# EasyEDA Pro project musclemap_pcb_header.eprj, schematic Schematic1
Board Name: Board1; Create Date: 2025-11-26; Page Name: P1; Project Name: musclemap_pcb_revised; Schematic Name: Schematic1; Update Date: 2025-11-26; Company: DWAN; Drawn: DWAN; Page Size: A4; Version: V1.0
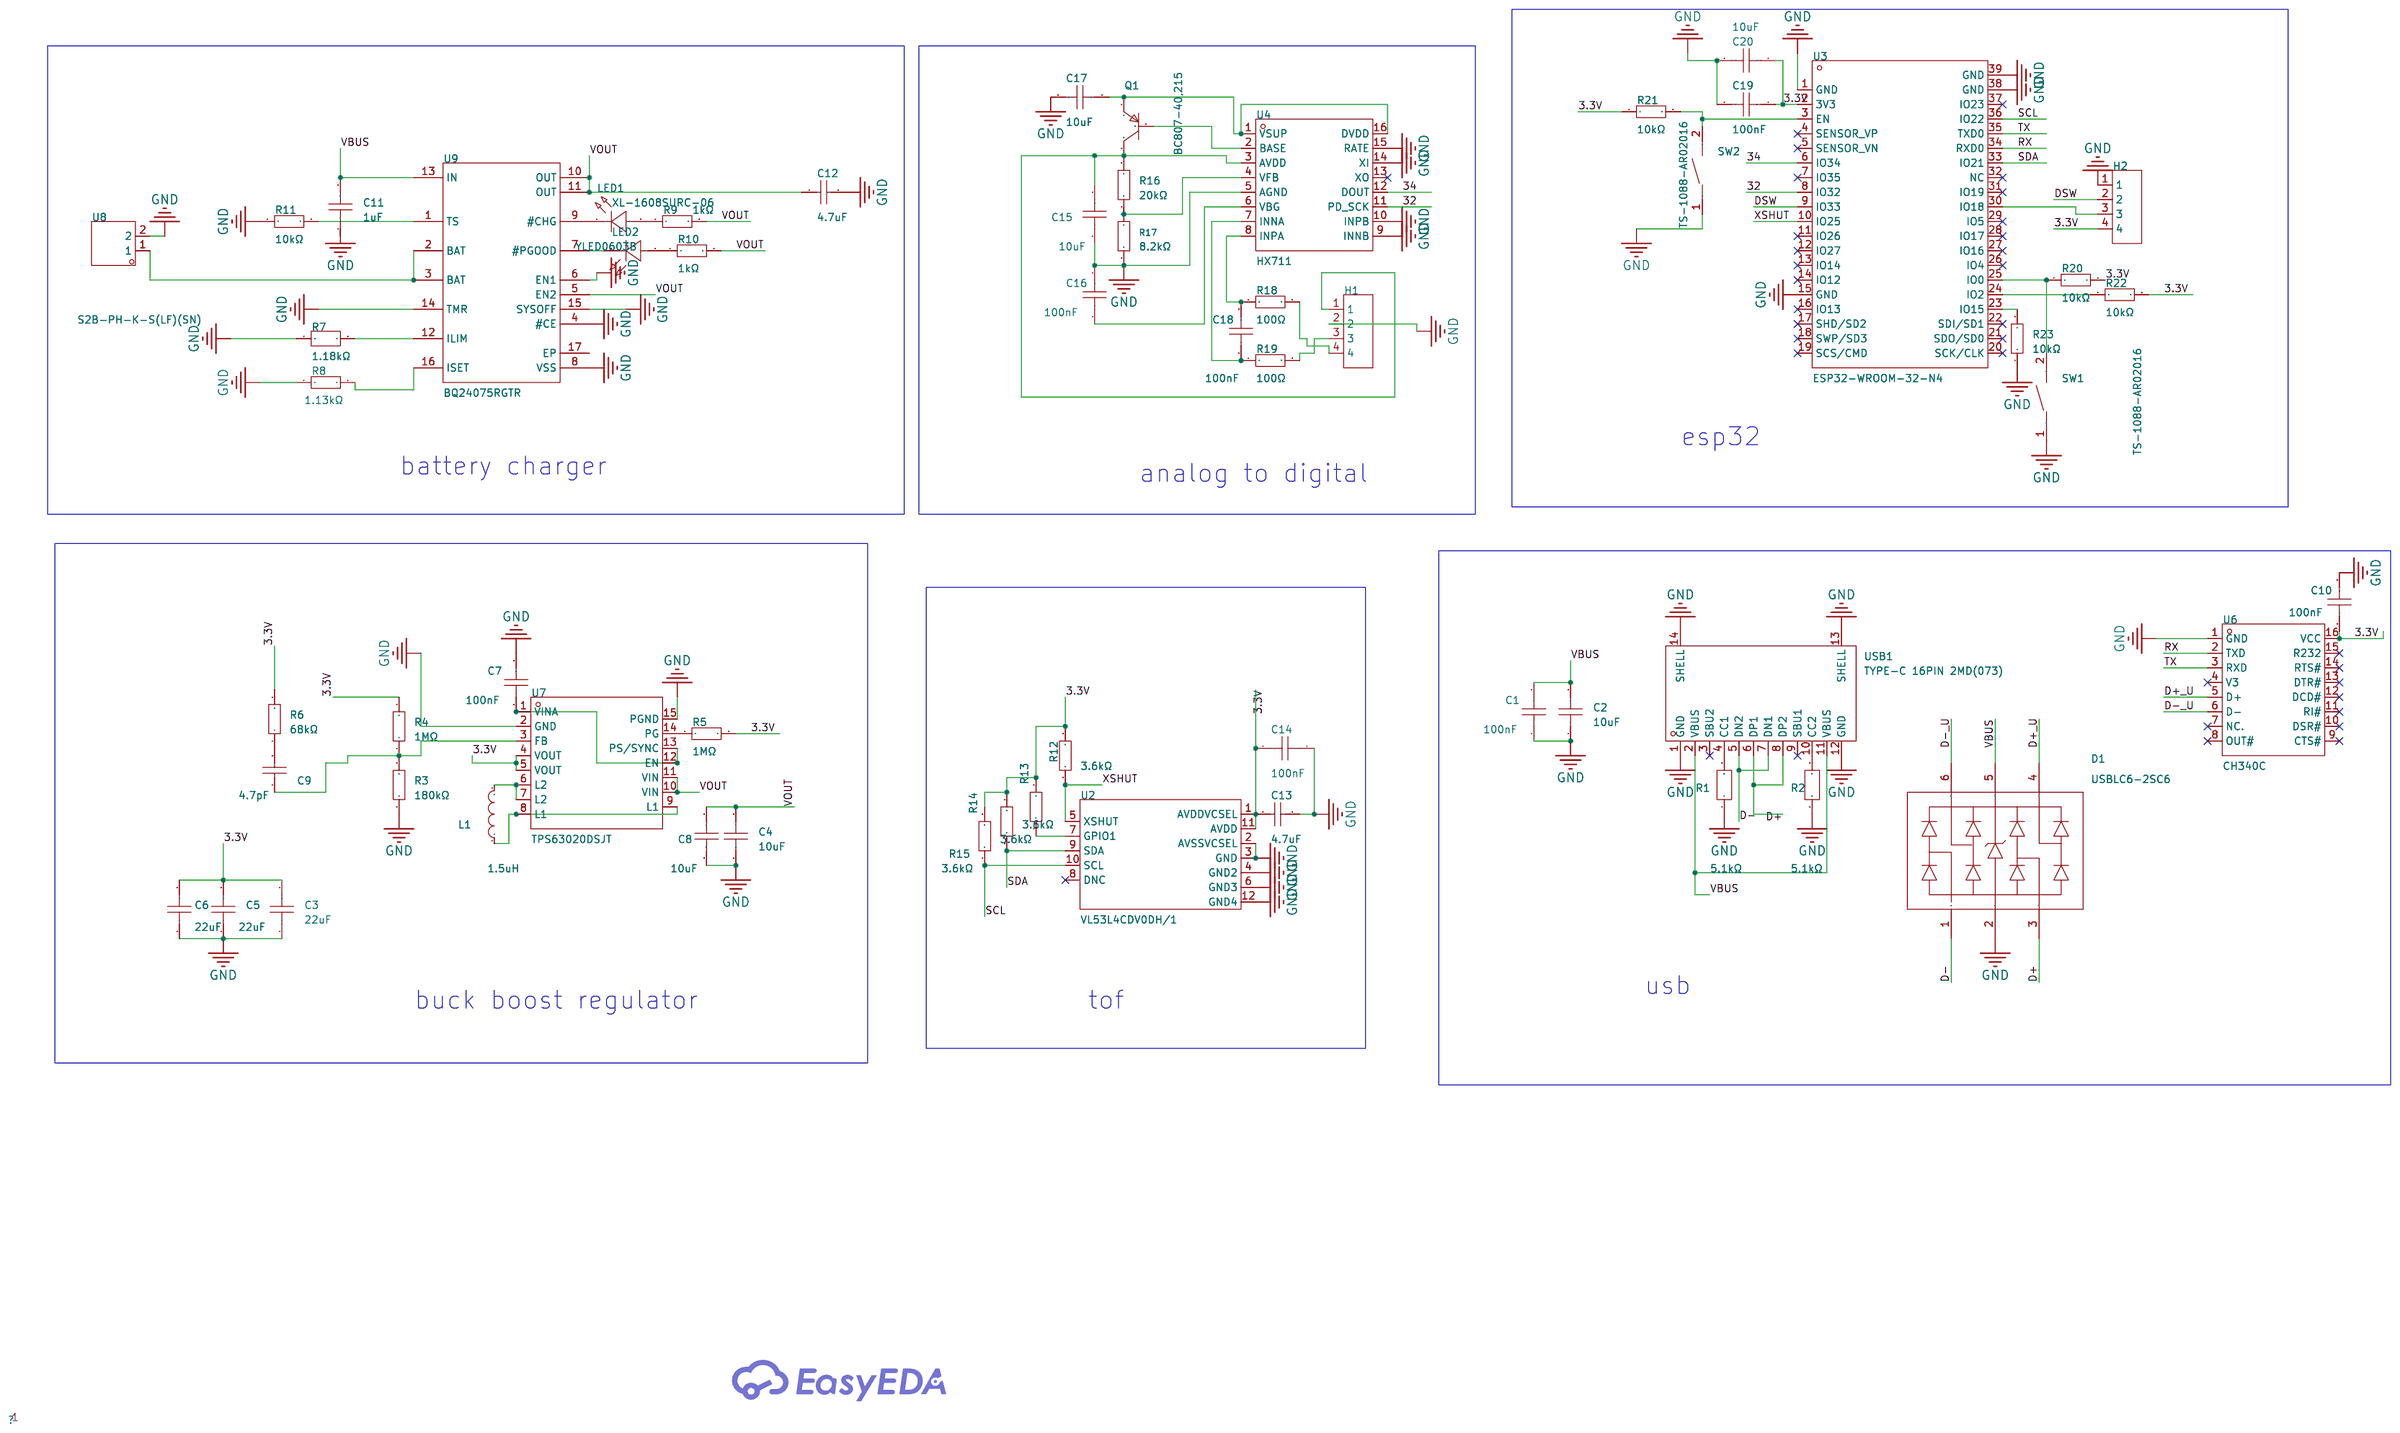
[diagram p0: schematic sheet]

## Parts
C1  100nF  [C0603]
C2  10uF  [C0805]
C3  22uF  [C0603]
C4  10uF  [C0805]
C5  22uF  [C0603]
C6  22uF  [C0603]
C7  100nF  [C0603]
C8  10uF  [C0805]
C9  4.7pF  [C0603]
C10  100nF  [C0603]
C11  1uF  [C0603]
C12  4.7uF  [C0805]
C13  4.7uF  [C0805]
C14  100nF  [C0603]
C15  10uF  [C0805]
C16  100nF  [C0603]
C17  10uF  [C0805]
C18  100nF  [C0603]
C19  100nF  [C0603]
C20  10uF  [C0805]
D1  USBLC6-2SC6  [SOT-23-6_L2.9-W1.6-P0.95-LS2.8-BL]
H1  -  [CONN-TH_B4B-XH-A-LF-SN]
H2  -  [CONN-TH_B4B-XH-A-LF-SN]
L1  1.5uH  [IND-SMD_L2.5-W2.0_MEKK2520TR47M]
LED1  XL-1608SURC-06  [LED0603-RD_RED]
LED2  YLED0603B  [LED0603-FD]
Q1  BC807-40,215  [SOT-23-3_L2.9-W1.3-P1.90-LS2.4-BR]
R1  5.1kΩ  [R0603]
R2  5.1kΩ  [R0603]
R3  180kΩ  [R0603]
R4  1MΩ  [R0603]
R5  1MΩ  [R0603]
R6  68kΩ  [R0603]
R7  1.18kΩ  [R0603]
R8  1.13kΩ  [R0603]
R9  1kΩ  [R0603]
R10  1kΩ  [R0603]
R11  10kΩ  [R0603]
R12  3.6kΩ  [R0603]
R13  3.6kΩ  [R0603]
R14  3.6kΩ  [R0603]
R15  3.6kΩ  [R0603]
R16  20kΩ  [R0603]
R17  8.2kΩ  [R0603]
R18  100Ω  [R0603]
R19  100Ω  [R0603]
R20  10kΩ  [R0603]
R21  10kΩ  [R0603]
R22  10kΩ  [R0603]
R23  10kΩ  [R0603]
SW1  TS-1088-AR02016  [SW-SMD_L3.9-W3.0-P4.45]
SW2  TS-1088-AR02016  [SW-SMD_L3.9-W3.0-P4.45]
U2  VL53L4CDV0DH/1  [LGA-12_L4.4-W2.4_VL53L0X]
U3  ESP32-WROOM-32-N4  [WIFIM-SMD_ESP32-WROOM-32-N4]
U4  HX711  [SOP-16_L10.0-W3.9-P1.27-LS6.0-BL]
U6  CH340C  [SOP-16_L10.0-W3.9-P1.27-LS6.0-BL]
U7  TPS63020DSJT  [VSON-14_L4.0-W3.0-P0.50-BL-EP_TI_DSJ]
U8  S2B-PH-K-S(LF)(SN)  [CONN-TH_S2B-PH-K-S-LF-SN]
U9  BQ24075RGTR  [QFN-16_L3.0-W3.0-P0.50-TL-EP1.7]
USB1  TYPE-C 16PIN 2MD(073)  [USB-C-SMD_TYPE-C-6PIN-2MD-073]

## Library data of the parts
C1 C7 C10 C14 C16 C18 C19 = CC0603KRX7R9BB104: Capacitance:100nF Tolerance:±10% Tolerance:±10% Voltage Rating:50V Temperature Coefficient:X7R; LCSC Part Name: 100nF ±10% 50V; Supplier Part: C14663; Manufacturer: YAGEO(国巨); Supplier Footprint: 0603; JLCPCB Part Class: Basic Part; Datasheet: https://item.szlcsc.com/datasheet/CC0603KRX7R9BB104/15331.html; Supplier: LCSC; Tolerance: ±10%; Voltage Rating: 50V; Temperature Coefficient: X7R
C2 C4 C8 C15 C17 C20 = CL21A106KAYNNNE_C15850: Capacitance:10uF Tolerance:±10% Tolerance:±10% Voltage Rating:25V Temperature Coefficient:X5R; LCSC Part Name: 10uF ±10% 25V; Supplier Part: C15850; Manufacturer: SAMSUNG(三星); Manufacturer Part: CL21A106KAYNNNE; Supplier Footprint: 0805; JLCPCB Part Class: Basic Part; Datasheet: https://item.szlcsc.com/datasheet/CL21A106KAYNNNE/16532.html; Supplier: LCSC; Tolerance: ±10%; Voltage Rating: 25V; Temperature Coefficient: X5R
C3 C5 C6 = CL10A226MP8NUNE: Capacitance:22uF Tolerance:±20% Tolerance:±20% Voltage Rating:10V Temperature Coefficient:X5R; LCSC Part Name: 22uF ±20% 10V; Supplier Part: C86295; Manufacturer: SAMSUNG(三星); Supplier Footprint: 0603; JLCPCB Part Class: Extended Part; Datasheet: https://item.szlcsc.com/datasheet/CL10A226MP8NUNE/87471.html; Supplier: LCSC; Tolerance: ±20%; Voltage Rating: 10V; Temperature Coefficient: X5R
C9 = 0603CG4R7C500NT: Capacitance:4.7pF Voltage Rating:50V Temperature Coefficient:C0G; LCSC Part Name: ±0.25pF 4.7pF 50V; Supplier Part: C1669; Manufacturer: FH(风华); Supplier Footprint: 0603; JLCPCB Part Class: Extended Part; Datasheet: https://item.szlcsc.com/datasheet/0603CG4R7C500NT/2021.html; Supplier: LCSC; Voltage Rating: 50V; Temperature Coefficient: C0G
C11 = CL10A105KB8NNNC: Capacitance:1uF Tolerance:±10% Tolerance:±10% Voltage Rating:50V Temperature Coefficient:X5R; LCSC Part Name: 1uF ±10% 50V; Supplier Part: C15849; Manufacturer: SAMSUNG(三星); Supplier Footprint: 0603; JLCPCB Part Class: Basic Part; Datasheet: https://item.szlcsc.com/datasheet/CL10A105KB8NNNC/16531.html; Supplier: LCSC; Tolerance: ±10%; Voltage Rating: 50V; Temperature Coefficient: X5R
C12 C13 = CL21A475KBQNNNE: Capacitance:4.7uF Tolerance:±10% Tolerance:±10% Voltage Rating:50V Temperature Coefficient:X5R; LCSC Part Name: 4.7uF ±10% 50V; Supplier Part: C98192; Manufacturer: SAMSUNG(三星); Supplier Footprint: 0805; JLCPCB Part Class: Extended Part; Datasheet: https://item.szlcsc.com/datasheet/CL21A475KBQNNNE/99401.html; Supplier: LCSC; Tolerance: ±10%; Voltage Rating: 50V; Temperature Coefficient: X5R
D1 = USBLC6-2SC6_C47147619: Reverse Stand-Off Voltage (Vrwm):5V Clamping Voltage:28V Voltage - Breakdown:6V Reverse Leakage Current (Ir):1uA Number of Channels:4 level of protection:IEC 61000-4-2 Type:ESD Junction Capacitance:0.4pF; LCSC Part Name: 四路ESD 四路ESD 5V截止; Supplier Part: C47147619; Manufacturer: KUU; Supplier Footprint: SOT-23-6L; JLCPCB Part Class: Extended Part; Datasheet: https://item.szlcsc.com/datasheet/USBLC6-2SC6/49348157.html; Supplier: LCSC; Reverse Stand-Off Voltage (Vrwm): 5V; Clamping Voltage: 28V; Voltage - Breakdown: 6V; Reverse Leakage Current (Ir): 1uA; Number of Channels: 4; level of protection: IEC 61000-4-2; Type: ESD; Junction Capacitance: 0.4pF
H1 H2 = B4B-XH-A(LF)(SN): Reference Series:XH Pitch:2.5mm Pins Structure:1x4P Number of Rows:1 Number of PINs Per Row:4 Row Spacing:- Mounting Style:- Contact Material:Brass; LCSC Part Name: XH插座 1*4P 间距2.5mm 直针; Supplier Part: C144395; Manufacturer: JST; Supplier Footprint: 插件,P=2.5mm; JLCPCB Part Class: Extended Part; Datasheet: https://atta.szlcsc.com/upload/public/pdf/source/20180327/C144395_D58F0D17A3F58B29FECD1B7D0A791262.pdf; Supplier: LCSC; Reference Series: XH; Pitch: 2.5mm; Pins Structure: 1x4P; Number of Rows: 1; Number of PINs Per Row: 4; Contact Material: Brass
L1 = FTC252012S1R5MBCA: Inductance:1.5uH Tolerance:±20% Tolerance:±20% Current Rating:3.7A Current - Saturation(Isat):4.5A DC Resistance(DCR):44mΩ Type:-; LCSC Part Name: 1.5uH ±20% 4.5A; Supplier Part: C5832371; Manufacturer: cjiang(长江微电); Supplier Footprint: 1008; JLCPCB Part Class: Extended Part; Datasheet: https://item.szlcsc.com/datasheet/FTC252012S1R5MBCA/6763491.html; Supplier: LCSC; Tolerance: ±20%; Current Rating: 3.7A; Current - Saturation(Isat): 4.5A; DC Resistance(DCR): 44mΩ
LED1 = XL-1608SURC-06: Lamp Holder Type:- Illumination Color:Red Voltage - Forward(Vf):2.3V Voltage - Forward(Vf):2.3V Power(Watts):50mW Forward Current:20mA Wavelength - Dominant:620nm~630nm Wavelength - Dominant:620nm~630nm Peak Wavelength:625nm Diode Configuration:- Lens Col; LCSC Part Name: 0603红色贴片式发光二极管; Supplier Part: C965799; Manufacturer: XINGLIGHT(成兴光); Supplier Footprint: 0603; JLCPCB Part Class: Extended Part; Datasheet: https://item.szlcsc.com/datasheet/XL-1608SURC-06/1051408.html; Supplier: LCSC; Illumination Color: Red; Voltage - Forward(Vf): 2.3V; Power(Watts): 50mW; Forward Current: 20mA; Wavelength - Dominant: 620nm~630nm; Peak Wavelength: 625nm; Lens Color: Water Clear; Luminous Intensity: 225mcd; Viewing Angle: 120°; Mounting Style: op View Mount; Operating Temperature: -40℃~+85℃
LED2 = YLED0603B: Lamp Holder Type:-；- Illumination Color:Blue Voltage - Forward(Vf):2.6V~3.2V Voltage - Forward(Vf):2.6V~3.2V Power(Watts):- Forward Current:30mA Wavelength - Dominant:460nm~475nm Wavelength - Dominant:460nm~475nm Peak Wavelength:- Diode Configuration:Disc; LCSC Part Name: 蓝色 独立二极管; Supplier Part: C19171394; Manufacturer: YONGYUTAI(永裕泰); Supplier Footprint: 0603; JLCPCB Part Class: Extended Part; Datasheet: https://item.szlcsc.com/datasheet/YLED0603B/20382445.html; Supplier: LCSC; Lamp Holder Type: -；-; Illumination Color: Blue; Voltage - Forward(Vf): 2.6V~3.2V; Forward Current: 30mA; Wavelength - Dominant: 460nm~475nm; Diode Configuration: Discrete Diode; Lens Color: -；-; Luminous Intensity: 42mcd~86mcd; Viewing Angle: 120°; Mounting Style: -；-; Operating Temperature: -40℃~+85℃
Q1 = BC807-40,215_C57316: type:PNP Current - Collector(Ic):500mA Collector - Emitter Voltage VCEO:45V Pd - Power Dissipation:250mW DC Current Gain:250@100mA,1V DC Current Gain:250@100mA,1V Transition frequency(fT):80MHz Current - Collector Cutoff:100nA Vce Saturation(VCE(sat)):700; LCSC Part Name: hfe=250~600 PNP 电流:500mA 电压:45V; Supplier Part: C57316; Manufacturer: Nexperia(安世); Supplier Footprint: SOT-23; JLCPCB Part Class: Extended Part; Datasheet: https://item.szlcsc.com/datasheet/BC807-40%252C215/58350.html; Supplier: LCSC; type: PNP; Current - Collector(Ic): 500mA; Collector - Emitter Voltage VCEO: 45V; Pd - Power Dissipation: 250mW; DC Current Gain: 250@100mA,1V; Transition frequency(fT): 80MHz; Current - Collector Cutoff: 100nA; Vce Saturation(VCE(sat)): 700mV; Operating Temperature: -65℃~+150℃
R1 R2 = FRC0603F5101TS: Type:Thick Film Resistor Resistance:5.1kΩ Tolerance:±1% Tolerance:±1% Power(Watts):100mW Voltage-Supply(Max):75V Temperature Coefficient:±100ppm/℃ Temperature Coefficient:±100ppm/℃ Operating Temperature:-55℃~+155℃ Operating Temperature:-55℃~+155℃; LCSC Part Name: 5.1kΩ ±1% 100mW 厚膜电阻; Supplier Part: C2907044; Manufacturer: FOJAN(富捷); Supplier Footprint: 0603; JLCPCB Part Class: Extended Part; Supplier: LCSC; Type: Thick Film Resistor; Tolerance: ±1%; Power(Watts): 100mW; Voltage-Supply(Max): 75V; Temperature Coefficient: ±100ppm/℃; Operating Temperature: -55℃~+155℃
R3 = RC0603FR-07180KL: Type:Thick Film Resistors Resistance: Tolerance:±1% Tolerance:±1% Power(Watts): Overload Voltage (Max): Temperature Coefficient:±100ppm/℃ Temperature Coefficient:±100ppm/℃ Operating Temperature Range:-55℃~+155℃ Operating Temperature Range:-55℃~+155℃; LCSC Part Name: 厚膜电阻 180kΩ ±1% 100mW; Supplier Part: C123419; Manufacturer: YAGEO(国巨); Supplier Footprint: 0603; JLCPCB Part Class: Extended Part; Datasheet: https://atta.szlcsc.com/upload/public/pdf/source/20180821/C275644_0D56F95EFF785E7D9A1FEF436B37DA78.pdf; Supplier: LCSC; Type: Thick Film Resistors; Tolerance: ±1%; Temperature Coefficient: ±100ppm/℃; Operating Temperature Range: -55℃~+155℃
R4 R5 = RC0603FR-071ML: Type:Thick Film Resistors Resistance: Tolerance:±1% Tolerance:±1% Power(Watts): Overload Voltage (Max): Temperature Coefficient:±100ppm/℃ Temperature Coefficient:±100ppm/℃ Operating Temperature Range:-55℃~+155℃ Operating Temperature Range:-55℃~+155℃; LCSC Part Name: 厚膜电阻 1MΩ ±1% 100mW; Supplier Part: C105578; Manufacturer: YAGEO(国巨); Supplier Footprint: 0603; JLCPCB Part Class: Extended Part; Datasheet: https://atta.szlcsc.com/upload/public/pdf/source/20181102/C105578_67A9388250AF143DE4682E62257D2969.pdf; Supplier: LCSC; Type: Thick Film Resistors; Tolerance: ±1%; Temperature Coefficient: ±100ppm/℃; Operating Temperature Range: -55℃~+155℃
R6 = RC0603FR-0768KL: Type:Thick Film Resistor Resistance:68kΩ Tolerance:±1% Tolerance:±1% Power(Watts):100mW Voltage-Supply(Max):75V Temperature Coefficient:±100ppm/℃ Temperature Coefficient:±100ppm/℃ Operating Temperature:-55℃~+155℃ Operating Temperature:-55℃~+155℃; LCSC Part Name: 厚膜电阻 68kΩ ±1% 100mW; Supplier Part: C114633; Manufacturer: YAGEO(国巨); Supplier Footprint: 0603; JLCPCB Part Class: Extended Part; Datasheet: https://item.szlcsc.com/datasheet/RC0603FR-0768KL/115877.html; Supplier: LCSC; Type: Thick Film Resistor; Tolerance: ±1%; Power(Watts): 100mW; Voltage-Supply(Max): 75V; Temperature Coefficient: ±100ppm/℃; Operating Temperature: -55℃~+155℃
R7 = RT0603BRD071K18L: Type:Thin Film Resistor Resistance:1.18kΩ Tolerance:±0.1% Tolerance:±0.1% Power(Watts):100mW Voltage-Supply(Max):75V Temperature Coefficient:±25ppm/℃ Temperature Coefficient:±25ppm/℃ Operating Temperature:-55℃~+155℃ Operating Temperature:-55℃~+155℃; LCSC Part Name: 薄膜电阻 1.18kΩ ±0.1% 100mW; Supplier Part: C861193; Manufacturer: YAGEO(国巨); Supplier Footprint: 0603; JLCPCB Part Class: Extended Part; Datasheet: https://item.szlcsc.com/datasheet/RT0603BRD071K18L/921531.html; Supplier: LCSC; Type: Thin Film Resistor; Tolerance: ±0.1%; Power(Watts): 100mW; Voltage-Supply(Max): 75V; Temperature Coefficient: ±25ppm/℃; Operating Temperature: -55℃~+155℃
R8 = 0603WAF1131T5E: Type:Thick Film Resistor Resistance:1.13kΩ Tolerance:±1% Tolerance:±1% Power(Watts):100mW Voltage-Supply(Max):75V Temperature Coefficient:±100ppm/℃ Temperature Coefficient:±100ppm/℃ Operating Temperature:-55℃~+155℃ Operating Temperature:-55℃~+155℃; LCSC Part Name: 1.13kΩ ±1% 100mW 厚膜电阻; Supplier Part: C22833; Manufacturer: UNI-ROYAL(厚声); Supplier Footprint: 0603; JLCPCB Part Class: Extended Part; Datasheet: https://item.szlcsc.com/datasheet/0603WAF1131T5E/23560.html; Supplier: LCSC; Type: Thick Film Resistor; Tolerance: ±1%; Power(Watts): 100mW; Voltage-Supply(Max): 75V; Temperature Coefficient: ±100ppm/℃; Operating Temperature: -55℃~+155℃
R9 R10 = RC0603FR-071KL: Type:Thick Film Resistor Resistance:1kΩ Tolerance:±1% Tolerance:±1% Power(Watts):100mW Voltage-Supply(Max):75V Temperature Coefficient:±100ppm/℃ Temperature Coefficient:±100ppm/℃ Operating Temperature:-55℃~+155℃ Operating Temperature:-55℃~+155℃; LCSC Part Name: 厚膜电阻 1kΩ ±1% 100mW; Supplier Part: C22548; Manufacturer: YAGEO(国巨); Supplier Footprint: 0603; JLCPCB Part Class: Extended Part; Datasheet: https://item.szlcsc.com/datasheet/RC0603FR-071KL/23274.html; Supplier: LCSC; Type: Thick Film Resistor; Tolerance: ±1%; Power(Watts): 100mW; Voltage-Supply(Max): 75V; Temperature Coefficient: ±100ppm/℃; Operating Temperature: -55℃~+155℃
R11 R20-R23 = RC0603FR-0710KL: Type:Thick Film Resistors Resistance: Tolerance:±1% Tolerance:±1% Power(Watts): Overload Voltage (Max): Temperature Coefficient:±100ppm/℃ Temperature Coefficient:±100ppm/℃ Operating Temperature Range:-55℃~+155℃ Operating Temperature Range:-55℃~+155℃; LCSC Part Name: 厚膜电阻 10kΩ ±1% 100mW; Supplier Part: C98220; Manufacturer: YAGEO(国巨); Supplier Footprint: 0603; JLCPCB Part Class: Extended Part; Datasheet: https://atta.szlcsc.com/upload/public/pdf/source/20180927/C295883_E8D83085EA81BD7DE0B2B681138C15EE.pdf; Supplier: LCSC; Type: Thick Film Resistors; Tolerance: ±1%; Temperature Coefficient: ±100ppm/℃; Operating Temperature Range: -55℃~+155℃
R12-R15 = RTT03362JTP: Type:Thick Film Resistor Resistance:3.6kΩ Tolerance:±5% Tolerance:±5% Power(Watts):100mW Voltage-Supply(Max):75V Temperature Coefficient:±100ppm/℃ Temperature Coefficient:±100ppm/℃ Operating Temperature:-55℃~+155℃ Operating Temperature:-55℃~+155℃; LCSC Part Name: 厚膜电阻 3.6kΩ ±5% 100mW; Supplier Part: C103578; Manufacturer: RALEC(旺诠); Supplier Footprint: 0603; JLCPCB Part Class: Extended Part; Datasheet: https://item.szlcsc.com/datasheet/RTT03362JTP/104793.html; Supplier: LCSC; Type: Thick Film Resistor; Tolerance: ±5%; Power(Watts): 100mW; Voltage-Supply(Max): 75V; Temperature Coefficient: ±100ppm/℃; Operating Temperature: -55℃~+155℃
R16 = RC0603FR-0720KL: Type:Thick Film Resistor Resistance:20kΩ Tolerance:±1% Tolerance:±1% Power(Watts):100mW Voltage-Supply(Max):75V Temperature Coefficient:±100ppm/℃ Temperature Coefficient:±100ppm/℃ Operating Temperature:-55℃~+155℃ Operating Temperature:-55℃~+155℃; LCSC Part Name: 厚膜电阻 20kΩ ±1% 100mW; Supplier Part: C105575; Manufacturer: YAGEO(国巨); Supplier Footprint: 0603; JLCPCB Part Class: Extended Part; Datasheet: https://item.szlcsc.com/datasheet/RC0603FR-0720KL/106790.html; Supplier: LCSC; Type: Thick Film Resistor; Tolerance: ±1%; Power(Watts): 100mW; Voltage-Supply(Max): 75V; Temperature Coefficient: ±100ppm/℃; Operating Temperature: -55℃~+155℃
R17 = 0603WAF8201T5E: Type:Thick Film Resistor Resistance:8.2kΩ Tolerance:±1% Tolerance:±1% Power(Watts):100mW Voltage-Supply(Max):75V Temperature Coefficient:±100ppm/℃ Temperature Coefficient:±100ppm/℃ Operating Temperature:-55℃~+155℃ Operating Temperature:-55℃~+155℃; LCSC Part Name: 8.2kΩ ±1% 100mW 厚膜电阻; Supplier Part: C25981; Manufacturer: UNI-ROYAL(厚声); Supplier Footprint: 0603; JLCPCB Part Class: Basic Part; Datasheet: https://item.szlcsc.com/datasheet/0603WAF8201T5E/26724.html; Supplier: LCSC; Type: Thick Film Resistor; Tolerance: ±1%; Power(Watts): 100mW; Voltage-Supply(Max): 75V; Temperature Coefficient: ±100ppm/℃; Operating Temperature: -55℃~+155℃
R18 R19 = RC0603FR-07100RL: Type:Thick Film Resistors Resistance: Tolerance:±1% Tolerance:±1% Power(Watts): Overload Voltage (Max): Temperature Coefficient:±100ppm/℃ Temperature Coefficient:±100ppm/℃ Operating Temperature Range:-55℃~+155℃ Operating Temperature Range:-55℃~+155℃; LCSC Part Name: 厚膜电阻 100Ω ±1% 100mW; Supplier Part: C105588; Manufacturer: YAGEO(国巨); Supplier Footprint: 0603; JLCPCB Part Class: Extended Part; Datasheet: https://atta.szlcsc.com/upload/public/pdf/source/20180316/70C0E2BDAE7FCC62C531A5A58D202EE1.pdf; Supplier: LCSC; Type: Thick Film Resistors; Tolerance: ±1%; Temperature Coefficient: ±100ppm/℃; Operating Temperature Range: -55℃~+155℃
SW1 SW2 = TS-1088-AR02016: Circuit:SPST Actuator Style:Round Button Operating Force:1.6N Mounting Type:Surface Mount,Vertical Length:4mm Width:3mm Switch Height:2mm with Bracket:Without Bracket Contact Current:50mA Voltage Rating:12V Actuator/Cap Color:Black Termination Style:SMD(S; LCSC Part Name: 4*3*2mm 立贴 轻触开关; Supplier Part: C720477; Manufacturer: XUNPU(讯普); Supplier Footprint: SMD,4x3mm; JLCPCB Part Class: Basic Part; Datasheet: https://item.szlcsc.com/datasheet/TS-1088-AR02016/763484.html; Supplier: LCSC; Circuit: SPST; Actuator Style: Round Button; Operating Force: 1.6N; Mounting Type: Surface Mount,Vertical; Length: 4mm; Width: 3mm; Switch Height: 2mm; with Bracket: Without Bracket; Contact Current: 50mA; Voltage Rating: 12V; Actuator/Cap Color: Black; Termination Style: SMD(SMT) Tab; Life: 100,000 Cycles; Operating Temperature: -30℃~+80℃
U2 = VL53L4CDV0DH/1: Supply Voltage:2.6V~3.5V Supply Voltage:2.6V~3.5V Iinearity Range:0cm~130cm Iinearity Range:0cm~130cm Supply Current:24mA; LCSC Part Name: I2C接口的飞行时间高精度接近传感器; Supplier Part: C3178291; Manufacturer: ST(意法半导体); Supplier Footprint: SMD-12P; JLCPCB Part Class: Extended Part; Datasheet: https://atta.szlcsc.com/upload/public/pdf/source/20221107/BE9994483FC65BEC03A9A3E978A2D9BD.pdf; Supplier: LCSC; Supply Voltage: 2.6V~3.5V; Iinearity Range: 0cm~130cm; Supply Current: 24mA
U3 = ESP32-WROOM-32-N4: LCSC Part Name: WiFi+蓝牙4.2+双核CPU模块; Supplier Part: C82899; Manufacturer: ESPRESSIF(乐鑫); Supplier Footprint: SMD,25.5x18mm; JLCPCB Part Class: Extended Part; Datasheet: https://item.szlcsc.com/datasheet/ESP32-WROOM-32-N4/84060.html; Supplier: LCSC
U4 = HX711_C6705483: resolution:24Bit number of channels:2 Supply Voltage:2.7V~5.5V Supply Voltage:2.7V~5.5V differential input:Yes Integral nonlinearity:- Integral nonlinearity:- Operating Temperature:-40℃~+85℃ Operating Temperature:-40℃~+85℃; Supplier Part: C6705483; Manufacturer: AVIA(海芯科技); Supplier Footprint: SOP-16; JLCPCB Part Class: Extended Part; Datasheet: https://atta.szlcsc.com/upload/public/pdf/source/20240910/523FF17855B2F1313F971C77291F913D.pdf; Supplier: LCSC; resolution: 24Bit; number of channels: 2; Supply Voltage: 2.7V~5.5V; differential input: Yes; Operating Temperature: -40℃~+85℃
U6 = CH340C: Applications Function:Transceiver USB Protocol:USB 2.0 Voltage - Supply:3.3V；5V Voltage - Supply:3.3V；5V Data Rate:2Mbps Operating Temperature:-20℃~+70℃ Operating Temperature:-20℃~+70℃ Current - Supply:7mA Supply Current (Iq):50uA; LCSC Part Name: USB转串口芯片; Supplier Part: C84681; Manufacturer: WCH(南京沁恒); Supplier Footprint: SOP-16; JLCPCB Part Class: Extended Part; Datasheet: https://item.szlcsc.com/datasheet/CH340C/85852.html; Supplier: LCSC; Applications Function: Transceiver; USB Protocol: USB 2.0; Voltage - Supply: 3.3V；5V; Data Rate: 2Mbps; Operating Temperature: -20℃~+70℃; Current - Supply: 7mA; Supply Current (Iq): 50uA
U7 = TPS63020DSJT: Function:Buck-Boost Output Type:- Voltage - Supply:1.8V~5.5V Voltage - Supply:1.8V~5.5V Output Voltage:- Output Voltage:- Output Current:- Frequency - Switching:2.4MHz Frequency - Switching:2.4MHz Operating Temperature:-40℃~+125℃@(TJ) Operating Temperatur; LCSC Part Name: 具有4A开关的高效率单电感器降压/升压转换器; Supplier Part: C544952; Manufacturer: TI(德州仪器); Supplier Footprint: VSON-14-EP(3x4); JLCPCB Part Class: Extended Part; Datasheet: https://www.ti.com/cn/lit/gpn/tps63021; Supplier: LCSC; Function: Buck-Boost; Voltage - Supply: 1.8V~5.5V; Frequency - Switching: 2.4MHz; Operating Temperature: -40℃~+125℃@(TJ); Synchronous Rectifier: Yes; Number of Outputs: 1; Topology: Buck-Boost; Switch tube (built-in/external): Built-In
U8 = S2B-PH-K-S(LF)(SN): Pins Structure:1x2P Pitch:2mm Mounting Type:Right Angle Reference Series:PH Number of Pins:2P Number of Rows:1 Number of PINs Per Row:2 Row Spacing:- Current Rating:2A Contact Material:Brass Contact Plating:Tin Operating Temperature:-25℃~+85℃ Operating Te; LCSC Part Name: 1x2P 间距:2mm 弯插 系列:PH; Supplier Part: C173752; Manufacturer: JST; Supplier Footprint: 弯插,P=2mm; JLCPCB Part Class: Extended Part; Datasheet: https://item.szlcsc.com/datasheet/S2B-PH-K-S(LF)(SN)/185142.html; Supplier: LCSC; Pins Structure: 1x2P; Pitch: 2mm; Mounting Type: Right Angle; Reference Series: PH; Number of Pins: 2P; Number of Rows: 1; Number of PINs Per Row: 2; Current Rating: 2A; Contact Material: Brass; Contact Plating: Tin; Operating Temperature: -25℃~+85℃; Voltage Rating: 100V; Plastic Material: PA66; Flame Retardant Rating: UL94V-0; Supplementary Features: K Pin; Color: White; Z-Height of the Board: 4.8mm; X-Length of Bottom Edge on Board (Spacing Line): 5.9mm; Y-Width of Bottom Edge on Board: 7.6mm
U9 = BQ24075RGTR: The Chip Type:Charging IC Voltage - Supply:4.35V~6.4V Voltage - Supply:4.35V~6.4V Charge Current - Max:1.5A Charging Saturation Voltage:4.2V Type of Battery:Lithium Battery Number of Cells:- Number of Cells:- Operating Temperature:-40℃~+125℃ Operating Tem; LCSC Part Name: 锂离子电池充电器和电源路径管理IC; Supplier Part: C15464; Manufacturer: TI(德州仪器); Supplier Footprint: QFN-16-EP(3x3); JLCPCB Part Class: Extended Part; Datasheet: http://www.ti.com/cn/lit/gpn/bq24075; Supplier: LCSC; The Chip Type: Charging IC; Voltage - Supply: 4.35V~6.4V; Charge Current - Max: 1.5A; Charging Saturation Voltage: 4.2V; Type of Battery: Lithium Battery; Operating Temperature: -40℃~+125℃; Battery Temperature Detection: Support; 0V Battery Charge: Not Supported
USB1 = TYPE-C 16PIN 2MD(073): Connector Type:Type-C Protocol Standard:- Gender:Female Mounting Type:Surface Mount, Right Angle Number of Contacts:16P Number of Ports:1 Current Rating-Power:3A Voltage Rating:5V Connect-Disconnect Life:5,000 Cycles Supplementary Features:- Center Height; LCSC Part Name: Type-C 母 卧贴; Supplier Part: C2765186; Manufacturer: SHOU HAN(首韩); Supplier Footprint: SMD; JLCPCB Part Class: Extended Part; Datasheet: https://item.szlcsc.com/datasheet/TYPE-C%252016PIN%25202MD(073)/2901843.html; Supplier: LCSC; Connector Type: Type-C; Gender: Female; Mounting Type: Surface Mount, Right Angle; Number of Contacts: 16P; Number of Ports: 1; Current Rating-Power: 3A; Voltage Rating: 5V; Connect-Disconnect Life: 5,000 Cycles; Detection color: Black; Operating Temperature: -25℃~+85℃

## Nets
3.3V: C3.2 C5.2 C6.2 C10.1 C13.2 C14.2 C19.1 C20.1 H2.4 R4.2 R5.2 R6.2 R12.2 R13.2 R14.2 R15.2 R20.2 R21.1 R22.2 U2.1(AVDDVCSEL) U2.11(AVDD) U3.2(3V3) U6.16(VCC) U7.4(VOUT) U7.5(VOUT)
GND: C1.1 C2.1 C3.1 C4.2 C5.1 C6.1 C7.2 C8.2 C10.2 C11.1 C12.1 C13.1 C14.1 C15.1 C16.2 C17.2 C19.2 C20.2 D1.2 H1.2 H2.1 R1.1 R2.1 R3.1 R7.1 R8.1 R11.1 R17.1 R23.1 SW1.1 SW2.1 U2.2(AVSSVCSEL) U2.3(GND) U2.4(GND2) U2.6(GND3) U2.12(GND4) U3.1(GND) U3.15(GND) U3.38(GND) U3.39(GND) U4.5(AGND) U4.9(INNB) U4.10(INPB) U4.14(XI) U4.15(RATE) U6.1(GND) U7.2(GND) U7.15(PGND) U8.2 U9.4(#CE) U9.6(EN1) U9.8(VSS) U9.14(TMR) U9.15(SYSOFF) USB1.1(GND) USB1.12(GND) USB1.13(SHELL) USB1.14(SHELL)
VBUS: C1.2 C2.2 C11.2 D1.5 U9.13(IN) USB1.2(VBUS) USB1.11(VBUS)
32: U3.8(IO32) U4.11(PD_SCK)
34: U3.6(IO34) U4.12(DOUT)
D+: D1.3 USB1.6(DP1) USB1.8(DP2)
D+_U: D1.4 U6.5(D+)
D-: D1.1 USB1.5(DN2) USB1.7(DN1)
D-_U: D1.6 U6.6(D-)
DSW: H2.2 U3.9(IO33)
RX: U3.34(RXD0) U6.2(TXD)
SCL: R15.1 U2.10(SCL) U3.36(IO22)
SDA: R14.1 U2.9(SDA) U3.33(IO21)
TX: U3.35(TXD0) U6.3(RXD)
VOUT: C4.1 C8.1 C12.2 R9.2 R10.2 U7.10(VIN) U7.11(VIN) U9.5(EN2) U9.10(OUT) U9.11(OUT)
XSHUT: R12.1 U2.5(XSHUT) U3.10(IO25)
$1N1499: R1.2 USB1.4(CC1)
$1N1538: R2.2 USB1.10(CC2)
$1N2804: L1.1 U7.8(L1) U7.9(L1)
$1N2809: L1.2 U7.6(L2) U7.7(L2)
$1N2919: R5.1 U7.14(PG)
$1N3098: C7.1 U7.1(VINA) U7.12(EN) U7.13(PS/SYNC)
$1N3230: C9.1 R3.2 R4.1 U7.3(FB)
$1N3482: C9.2 R6.1
$1N4163: R7.2 U9.12(ILIM)
$1N4202: R8.2 U9.16(ISET)
$1N4584: LED1.1(K) U9.9(#CHG)
$1N4586: LED1.2(A) R9.1
$1N4675: LED2.2(K) U9.7(#PGOOD)
$1N4721: LED2.1(A) R10.1
$1N4792: R11.2 U9.1(TS)
$1N4858: U8.1 U9.2(BAT) U9.3(BAT)
$1N5175: R13.1 U2.7(GPIO1)
$1N5467: C17.1 Q1.2(E) U4.1(VSUP) U4.16(DVDD)
$1N5724: R16.1 R17.2 U4.4(VFB)
$1N5741: Q1.1(B) U4.2(BASE)
$1N5746: C15.2 H1.1 Q1.3(C) R16.2 U4.3(AVDD)
$1N5829: C16.1 U4.6(VBG)
$1N6086: C18.2 R18.1 U4.8(INPA)
$1N6088: C18.1 R19.1 U4.7(INNA)
$1N6257: H1.4 R18.2
$1N6263: H1.3 R19.2
$1N6579: R20.1 SW1.2 U3.25(IO0)
$1N6780: R21.2 SW2.2 U3.3(EN)
$1N6891: R22.1 U3.24(IO2)
$1N6937: R23.2 U3.23(IO15)
$1N12271: H2.3 U3.30(IO18)

Not connected (* = marked no-connect by the designer): U2 8(DNC)*; U3 4(SENSOR_VP)* 5(SENSOR_VN)* 7(IO35)* 11(IO26)* 12(IO27)* 13(IO14)* 14(IO12)* 16(IO13)* 17(SHD/SD2)* 18(SWP/SD3)* 19(SCS/CMD)* 20(SCK/CLK)* 21(SDO/SD0)* 22(SDI/SD1)* 26(IO4)* 27(IO16)* 28(IO17)* 29(IO5)* 31(IO19)* 32(NC)* 37(IO23)*; U4 13(XO)*; U6 4(V3)* 7(NC.)* 8(OUT#)* 9(CTS#)* 10(DSR#)* 11(RI#)* 12(DCD#)* 13(DTR#)* 14(RTS#)* 15(R232)*; U9 17(EP); USB1 3(SBU2)* 9(SBU1)*

## Notes on the sheet
- esp32
- battery charger
- analog to digital
- usb
- buck boost regulator
- tof
